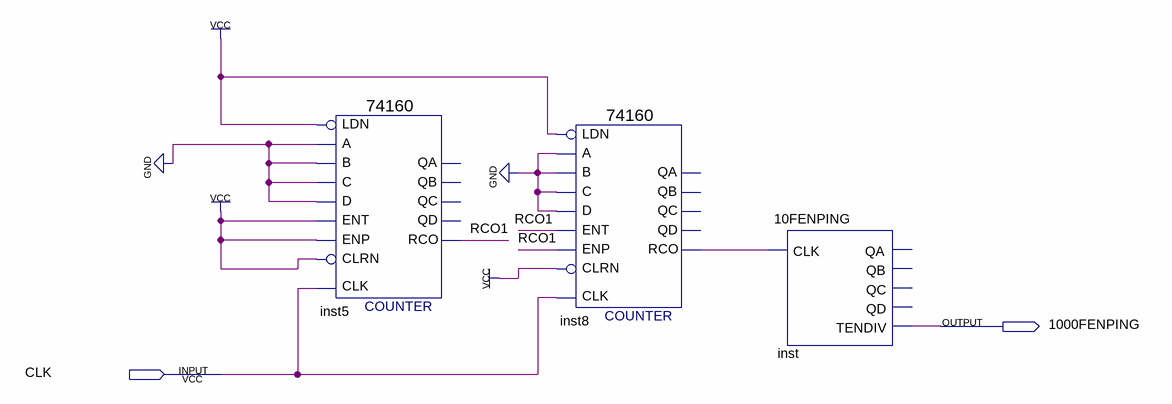
[diagram p0: schematic sheet]
// Quartus schematic 1000FENPING.bdf as structural Verilog: 3 symbols, 2 pins
module \1000FENPING  (
  input  CLK,
  output \1000FENPING 
);

  wire inst8_rco, RCO1;

  \74160  inst5 (
    .CLK(CLK), .ENT(1'b1), .A(1'b0), .B(1'b0), .C(1'b0), .D(1'b0), .LDN(1'b1), .ENP(1'b1), .CLRN(1'b1),
    .RCO(RCO1));  // open: QD, QA, QB, QC
  \74160  inst8 (
    .CLK(CLK), .ENT(RCO1), .A(1'b0), .B(1'b0), .C(1'b0), .D(1'b0), .LDN(1'b1), .ENP(RCO1), .CLRN(1'b1),
    .RCO(inst8_rco));  // open: QD, QA, QB, QC
  \10FENPING  inst (.CLK(inst8_rco), .TENDIV(\1000FENPING ));  // open: QA, QB, QC, QD
endmodule
